# Altium schematic sheet PowerPCB.SchDoc
size A4
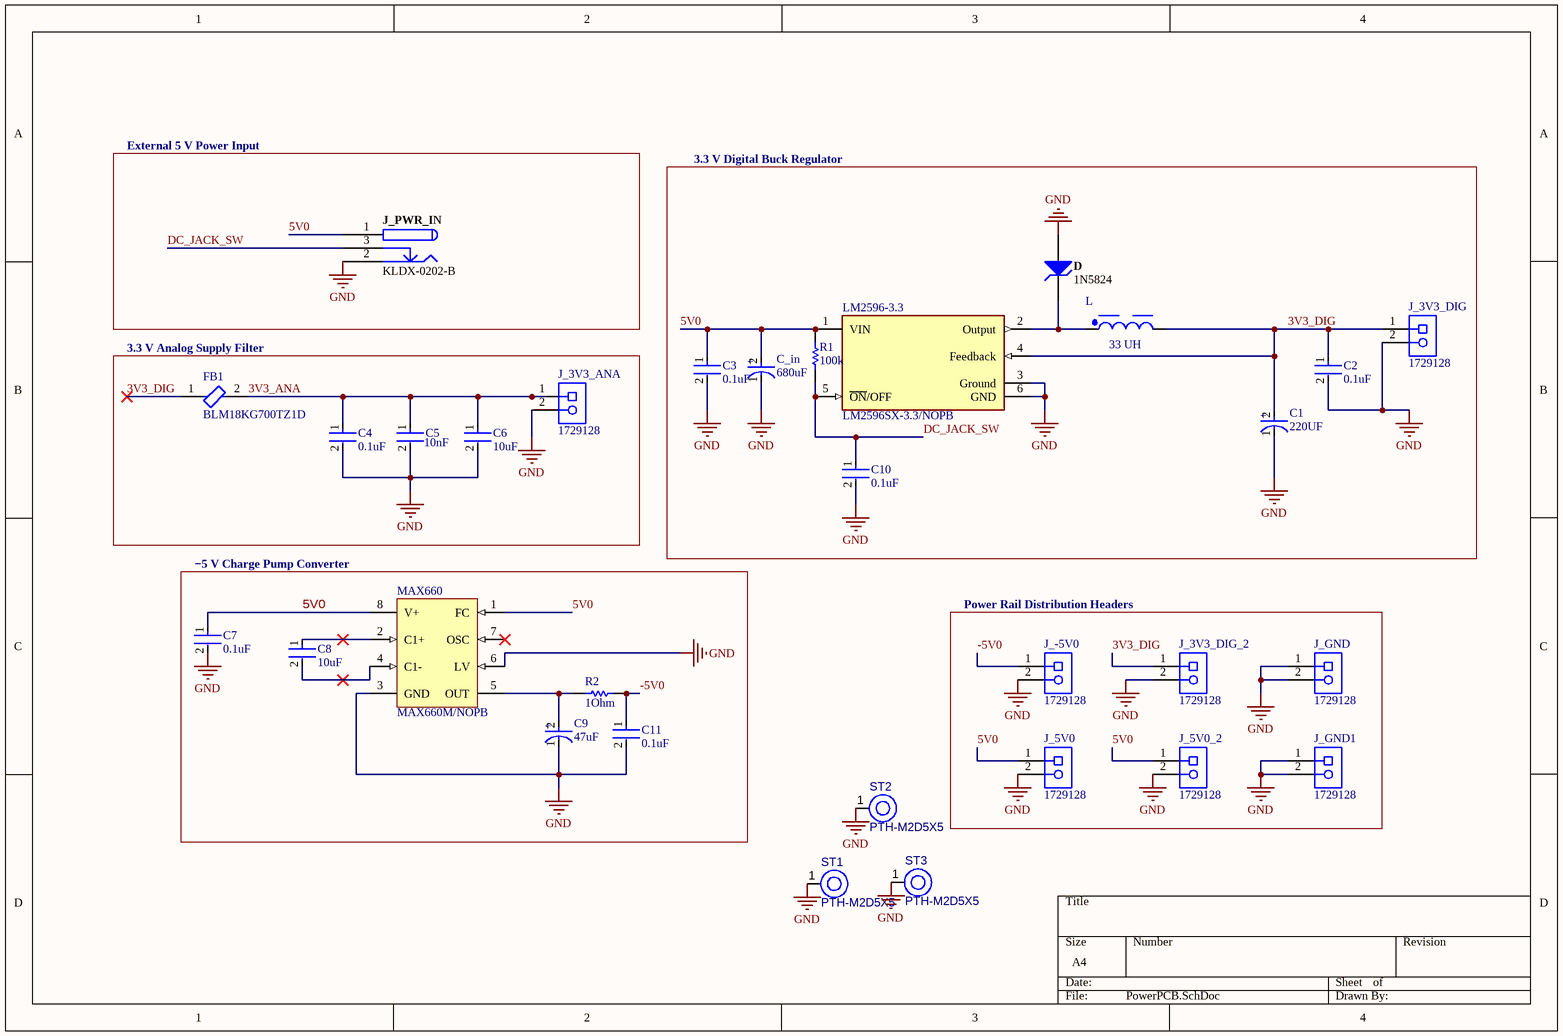
[diagram p0: PowerPCB.SchDoc]

## Parts
C1  220UF  [FP-RAD-TH-D_6_3_0_5-L_11-MFG]
C2  0.1uF  [FP-RDE0M1-MFG]
C3  0.1uF  [FP-RDE0M1-MFG]
C4  0.1uF  [FP-RDE0M1-MFG]
C5  10nF  [FP-RDE0M1-MFG]
C6  10uF  [FP-RDE2P1-MFG]
C7  0.1uF  [FP-RDE0M1-MFG]
C8  10uF  [FP-RDE2P1-MFG]
C9  47uF  [FP-RAD-TH-D_6_3_0_5-L_11-MFG]
C10  0.1uF  [FP-RDE0M1-MFG]
C11  0.1uF  [FP-RDE0M1-MFG]
C_in  680uF  [FP-RAD-TH-D_10_0_5-L_25_2-MFG]
D  1N5824  [FAIR-DO-41-2_V]
FB1  BLM18KG700TZ1D  [FP-BLM18-0_15-t0_6-d1_2-IPC_A]
J_3V3_ANA  1729128  [PHOE-1729128-2_V]
J_3V3_DIG  1729128  [PHOE-1729128-2_V]
J_3V3_DIG_2  1729128  [PHOE-1729128-2_V]
J_5V0  1729128  [PHOE-1729128-2_V]
J_5V0_2  1729128  [PHOE-1729128-2_V]
J_-5V0  1729128  [PHOE-1729128-2_V]
J_GND  1729128  [PHOE-1729128-2_V]
J_GND1  1729128  [PHOE-1729128-2_V]
J_PWR_IN  KLDX-0202-B  [KYCN-KLDX-0202-B_V]
L  33 UH  [WE-TIS_1111]
LM2596-3.3  LM2596SX-3.3/NOPB  [FP-KTT0005B-MFG]
MAX660  MAX660M/NOPB  [D0008A_L]
R1  100k  [RESA60-630X240]
R2  1Ohm  [RESA60-630X240]
ST1  PTH-M2D5X5  [PTH-M2D5X5]
ST2  PTH-M2D5X5  [PTH-M2D5X5]
ST3  PTH-M2D5X5  [PTH-M2D5X5]

## Blocks framed on the sheet
External 5 V Power Input: J_PWR_IN
3.3 V Digital Buck Regulator: C1-C3 C10 C_in D J_3V3_DIG L LM2596-3.3 R1
3.3 V Analog Supply Filter: C4-C6 FB1 J_3V3_ANA
−5 V Charge Pump Converter: C7-C9 C11 MAX660 R2
Power Rail Distribution Headers: J_3V3_DIG_2 J_5V0 J_5V0_2 J_-5V0 J_GND J_GND1

## Nets
GND: C1.1(C) C2.2 C3.2 C4.2 C5.2 C6.2 C7.2 C9.1(C) C10.2 C11.2 C_in.1(C) D.1(A) J_3V3_ANA.2 J_3V3_DIG.2 J_3V3_DIG_2.2 J_5V0.2 J_5V0_2.2 J_-5V0.2 J_GND.1 J_GND.2 J_GND1.1 J_GND1.2 J_PWR_IN.2 LM2596-3.3.3(Ground) LM2596-3.3.6(GND) MAX660.3(GND) MAX660.6(LV) ST1.1(H1) ST2.1(H1) ST3.1(H1)
3V3_ANA: C4.1 C5.1 C6.1 FB1.2 J_3V3_ANA.1
3V3_DIG: C1.2(A) C2.1 FB1.1 J_3V3_DIG.1 J_3V3_DIG_2.1 L.2 LM2596-3.3.4(Feedback)
5V0: C3.1 C7.1 C_in.2(A) J_5V0.1 J_5V0_2.1 J_PWR_IN.1 LM2596-3.3.1(VIN) MAX660.1(FC) MAX660.8(V+) R1.2
-5V0: C11.1 J_-5V0.1 R2.2
DC_JACK_SW: C10.1 J_PWR_IN.3 LM2596-3.3.5(~{ON}/OFF) R1.1
NetC8_1: C8.1 MAX660.2(C1+)
NetC8_2: C8.2 MAX660.4(C1-)
NetC9_2: C9.2(A) MAX660.5(OUT) R2.1
NetD_2: D.2(K) L.1 LM2596-3.3.2(Output)

Not connected (* = marked no-connect by the designer): MAX660 7(OSC)*

## Notes on the sheet
- (in symbol CMP-05427-000685-1) +
- (in symbol CMP-05427-000942-1) +
- (in symbol CMP-05427-001807-1) +

## Library data of the parts
C1 = CMP-05427-000685-1: Aluminum Electrolytic Capacitors (Radial Lead Type) AEC-Q200 Qualified 220uF ±20% 16V; Ripple Current: 180mA; Lead/Base Style: Straight; Life (Hours): 1000Hour; Lead Diameter: 0.5mm; Mount: Through Hole; Lead Pitch: 5mm; Case/Package: Radial; Min Operating Temperature: -55°C; Height - Seated (Max): 0.48inch; RoHS Compliant: Yes; Radiation Hardening: No; Tolerance: 20%; Packaging: Ammo Pack; Voltage Rating: 16V; Voltage Rating (DC): 16V; Max Operating Temperature: 105°C; Series: NHG; Package Quantity: 2000; Height: 11.2mm; Termination: Radial; Length: 11.2mm; Capacitance: 220uF; Diameter: 6.3mm
C2-C4 C7 C10 C11 = CMP-06035-027534-1: Ceramic Capacitor 100nF ±10% 25V X7R Radial; Lead Diameter: 0.5mm; Tolerance: 10%; Min Operating Temperature: -55°C; Capacitance: 100nF; Dielectric: X7R; Termination: Radial; Height - Seated (Max): 0.236inch; Voltage Rating: 25V; Package Quantity: 2000; Height: 3.5mm; Max Operating Temperature: 125°C; Resistor Type: Ceramic; Lead Free: Lead Free; Case/Package: Radial; Mount: Through Hole; Packaging: Tape and Reel; Voltage Rating (DC): 25V; Width: 3.5mm; Length: 0.157inch; Lead Pitch: 0.197inch
C5 = CMP-06035-046067-1: Ceramic Capacitor 10nF ±10% 100V X7R Radial; Lead Diameter: 0.5mm; Lead/Base Style: Kinked; Capacitance: 10nF; Length: 0.157inch; Voltage Rating (DC): 100V; Tolerance: 10%; Termination: Radial; Resistor Type: Ceramic; Width: 0.098inch; Min Operating Temperature: -55°C; Mount: Through Hole; Voltage Rating: 100V; Height - Seated (Max): 0.236inch; Packaging: Cut Tape; Lead Pitch: 0.197inch; Package Quantity: 1; Dielectric: X7R; Height: 3.5mm; Case/Package: Radial; Max Operating Temperature: 125°C
C6 C8 = CMP-06035-025589-1: Ceramic Capacitor 10uF ±10% 25V X7S Radial; Lead Diameter: 0.5mm; Lead/Base Style: Kinked; Case/Package: Radial; Voltage Rating: 25V; Termination: Radial; Package Quantity: 500; Max Operating Temperature: 125°C; Height: 4mm; Length: 5.5mm; Voltage Rating (DC): 25V; Width: 0.124inch; Tolerance: 10%; Mount: Through Hole; Height - Seated (Max): 0.236inch; Packaging: Bulk; Capacitance: 10uF; Min Operating Temperature: -55°C; Dielectric: X7S; Resistor Type: Ceramic; Lead Pitch: 0.098inch
C9 = CMP-05427-000942-1: Aluminum Electrolytic Capacitors (Radial Lead Type) 47uF ±20% 63V; Ripple Current: 284mA; Life (Hours): 5000Hour; Impedance: 210mR; Lead Diameter: 0.5mm; Lead Pitch: 5mm; Height - Seated (Max): 0.5inch; Capacitance: 47uF; Package Quantity: 1; Series: FR; Case/Package: Radial; Max Operating Temperature: 105°C; Voltage Rating (DC): 63V; Lead Free: Lead Free; Tolerance: 20%; Min Operating Temperature: -40°C; ESR (Equivalent Series Resistance): 210mR; RoHS Compliant: Yes; Voltage Rating: 63V; Height: 11.2mm; Radiation Hardening: No; Mount: Through Hole; Diameter: 6.3mm; Termination: Radial; Length: 11.2mm; Packaging: Tape and Reel; REACH SVHC: Yes
C_in = CMP-05427-001807-1: Aluminum Electrolytic Capacitors (Radial Lead Type) 680uF ±20% 35V
D = CMP-0892-00012-1: Zener Diode, 7.5V, 1W, 5%, -65 to 200 degC, 2-Pin DO-41, Body 2.72 x 5.2 mm, RoHS; PartNumber: 1N4737A; Manufacturer: Fairchild Semiconductor; VZ (Min.) (V): 7.125; ZZ (Max) (ohm): 3.5; Test Current IZ (mA): 34; IR (uA): 10; VZ (Max.) (V): 7.875; PD (W): 1; PackageReference: DO-41-2; RoHS: TRUE; DatasheetVersion: Rev. H3; ComponentLink1Description: Manufacturer URL; ComponentLink2URL: http://www.fairchildsemi.com/ds/1N/1N4744A.pdf; Tolerance: 5%; ComponentLink2Description: Datasheet; Operating and Storage Temperature Range: -65 to 200 degC; ComponentLink3URL: http://www.fairchildsemi.com/dwg/DO/DO41A.pdf; PackageDescription: 2-Pin Axial leaded, Body 2.72 x 5.2 mm, Lead Spread 25.4 mm; ComponentLink1URL: http://www.fairchildsemi.com/; ComponentLink3Description: Package Specification; PackageVersion: Rev. 2; Mounting Technology: Through Hole
FB1 = CMP-06046-001603-2: Chip Ferrite Bead Array, 0603, 70Ω @ 100MHz, 25%, 0.022Ω, 3.5A; RoHS Compliant: Yes
J_3V3_ANA J_3V3_DIG J_3V3_DIG_2 J_5V0 J_5V0_2 J_-5V0 J_GND J_GND1 = CMP-2000-05815-1: PCB Terminal Block, 13.5 A, 400 V, 2-Pin THD, RoHS, Bulk; Manufacturer: Phoenix Contact; Package Version: 03/2015; No. of Rows: 1; Pitch: 5.08mm; No. of Positions: 2; Voltage Rating: 400V; Current Rating: 13500mA; Manufacturer URL: http://www.phoenixcontact.com/; Datasheet URL: https://datasheet.ciiva.com/16046/1729128-16046181.pdf; RoHS: TRUE; Package URL: https://www.phoenixcontact.com/online/portal/pi/pxc/product_detail_page/!ut/p/b1/3VdJjqNKFDxLH8AFycySyWY2ozFsEPOMMQaDOX1XedGL_1Vdm5YXJleknhSKeBkvI6EA8ncAo3AYoDhBQGco6KN7VURTdemj9us_IEKEZo_YHiPAEWEFmDGOHMORkqKYCORBZxgL7ZoaZYcbFFUZ3fqxSY6GOuxydWUuHqz1ynmMFygu583Bob0Ewr6Sd_l-5m-kAueHiB0jpRwZwe58wwtkpxtMYd_LmGcDRU02dRNEyWt6Y2ti5pSyJ_reIkzIulrqApdnbT11V5jnCKbYNCvhEM1MCpPByat_X379-iThf08CI5GfOPqfBeS3BRoBOdD55AKVv0iLwCMq-2BrzXWSGRH7pUGD9uwXQjiph3xL0DKQwdGa0JImiIOmBNOestqgwTHSSs2oOep-78apyXQBvNi8ZLaFjvjWvcaUEBu0MC6Wbe-d6mB0FAebo2lUWinqYaZs5DAYzV0RP9yitUjnGJ0iI9xhZkT42OCQNUJJhkgWINNQLP2JFP6OpMg3JCVg70jqHT0lvKOnhHf0lPuOnnLf0VPuWx6_dxwUIvwk5WMkT0kLL1mh61l2yZVSzG3pYV_bqo-mj6uMKwKwdnnW8Jh5RTOJzMOA5c-eJDaZQw4mTMPH02PvS_ZAqNVjVTo2WyYLkwH_KU1mmmG5kjRhDqPXLwwVHvVOjCM60-fpXvTDfMGW1PVFVS1r4e4yVDk4ZdNbkUHvqPqQSeian4UD39fNKmachqdJ1NJbyk8rXT9mXTvPk3oE5meulKGgiruPJek-4I9hTT6G8ZLOyRSm2RRVbThERQad5OS28hdt4YW4vG0stgYYzsWsK4_7y6DZMjJSCqri1kyiZR5vD7pwIrNR7QwPHTcLTI5qT7eRlpHrdGiupYlqQDJ7zy_CND8fWWBoLRXxk1RVcXiBQwbTD4Xi7KL-FuO94t9xaqweXzH; PartNumber: 1729128; Package Description: 2-Pin Through Hole Device, Body 8.1 x 10.16 mm, Pitch 5.08 mm; Datasheet Version: 12/2013; Mounting Technology: ThroughHole; Orientation: Horizontal; Package Reference: 1729128-2; Packing: Bulk
J_PWR_IN = CMP-0256-00001-1: 3 Conductor Power Jack, 2 break 2 aux contacts; ComponentLink2URL: http://anacapa.kycon.com/Catalog_PDF/KLDX_0202.pdf; PackageReference: KLDX-0202-B; Contact Finish: Brass; ComponentLink2Description: Datasheet; Mounting Technology: Through Hole; PackageDescription: Jack, 9 x 14.5 mm Body, 2.5 mm Center Pin Diameter; ComponentLink1Description: Manufacturer URL; PartNumber: KLDX-0202-B; ComponentLink1URL: http://kycon.com/
L = CMP-1406-00003-3: Inductor Power Shielded Wirewound 33uH 20% 1KHz Ferrite 3.6A 61mOhm DCR RDL Tray; Self Resonant Frequency: 10MHz; Inductance: 33µH; Saturation Current: 2.8A; Current Rating: 3A; DC Resistance (DCR): 57mΩ; Series Resistance: 50mΩ; Lead Diameter: 650µm; Height: 11.5mm; Lead Pitch: 5mm; Features: Shielded; Min Operating Temperature: -40°C; Ambient Temperature Range Low: -40°C; Frequency: 10MHz; Ambient Temperature Range High: 85°C; RMS Current (Irms): 3.6A; Inductance Tolerance: 20%; Mount: Radial, Through Hole; Length: 11mm; Core Material: Ferrite; REACH SVHC: Unknown; Max Operating Temperature: 125°C; Max DC Current: 3.6A; Shielding: Shielded; Case/Package: Radial; Tolerance: 20%; Width: 11mm; Diameter: 11mm; Test Frequency: 1kHz; RoHS: Compliant; Number of Pins: 2
LM2596-3.3 = CMP-04918-000394-1: IC REG BUCK 3.3V 3A TO263-5; Synchronous Rectifier: No; Output Configuration: Positive; Min Supply Voltage: 4.5V; Operating Supply Voltage: 40V; Output Type: Fixed; Switching Frequency: 173kHz; Quiescent Current: 5mA; Efficiency: 73%; Number of Outputs: 1; Output Voltage: 3.3V; Lead Free: Contains Lead; Max Output Current: 3A; Packaging: Cut Tape; Case/Package: TO-263-5; RoHS Compliant: Yes; Output Current: 3A; Series: LM2596; Min Input Voltage: 4.5V; Min Operating Temperature: -40°C; Number of Pins: 5; REACH SVHC: No SVHC; Min Output Voltage: 3.3V; Radiation Hardening: No; Weight: 0.056128oz; Max Input Voltage: 40V; Nominal Output Voltage: 3.3V; Package Quantity: 500; Mount: Surface Mount; Operating Supply Current: 5mA; Max Operating Temperature: 125°C
MAX660 = CMP-0065-00036-3: Switched Capacitor Voltage Converter, 8-pin Narrow SOIC, Pb-Free; Manufacturer: Texas Instruments; PackageTopMarking: NSZXTT*MAX*660M; CompType: Switch Caps; PowerWise: N; PackageReference: D0008A; ComponentLink1URL: http://www.ti.com/general/docs/lit/getliterature.tsp?genericPartNumber=MAX660&fileType=pdf; Code_JEDEC: MS-012-AA; PinCount: 8; RoHS: Y; ComponentLink1Description: Datasheet URL; PackageDescription: SOIC Narrow, 4.9 x 3.9 x 1.45mm, 8 Lead, 1.27mm Pitch; Code_IPC: SOIC127P600-8
R1 R2 = CMP-1659-00070-1: Axial Resistor, 1 MOhm, +/- 1%, 250 mW, -55 to 155 degC, 2-Pin THD, RoHS, Bulk; Power Rating: 250 mW; Resistance: 47.5 kohm; Voltage Rating: 250 V; ComponentLink1Description: Manufacturer URL; PackageReference: MFR-25; ComponentLink2Description: Datasheet; ComponentLink2URL: http://www.yageo.com/documents/recent/Yageo%20LR_MFR_2013.pdf; Tolerance: 1%; DatasheetVersion: Apr-13; Package Quantity: 200; Packaging: Bulk; Case\Package: Axial; RoHSCompliant: true; ComponentLink1URL: http://www.yageo.com/; Length: 0.248 inch; Min Operating Temperature: -55 degC; Mount: Through Hole; PackageDescription: 2-Pin Axial Lead, Dia 2.4 mm, Body Length 6.3 mm; Max Operating Temperature: 155 degC
ST1-ST3 = CMP-00028-00004-2: M2 PTH (2.5mm), 5mm pad; Pins: 1